# Altium schematic sheet proj_arhipov_buck.SchDoc: =title_line_1 + title_line_2
size 594 x 420 mm; SheetNumber: 2
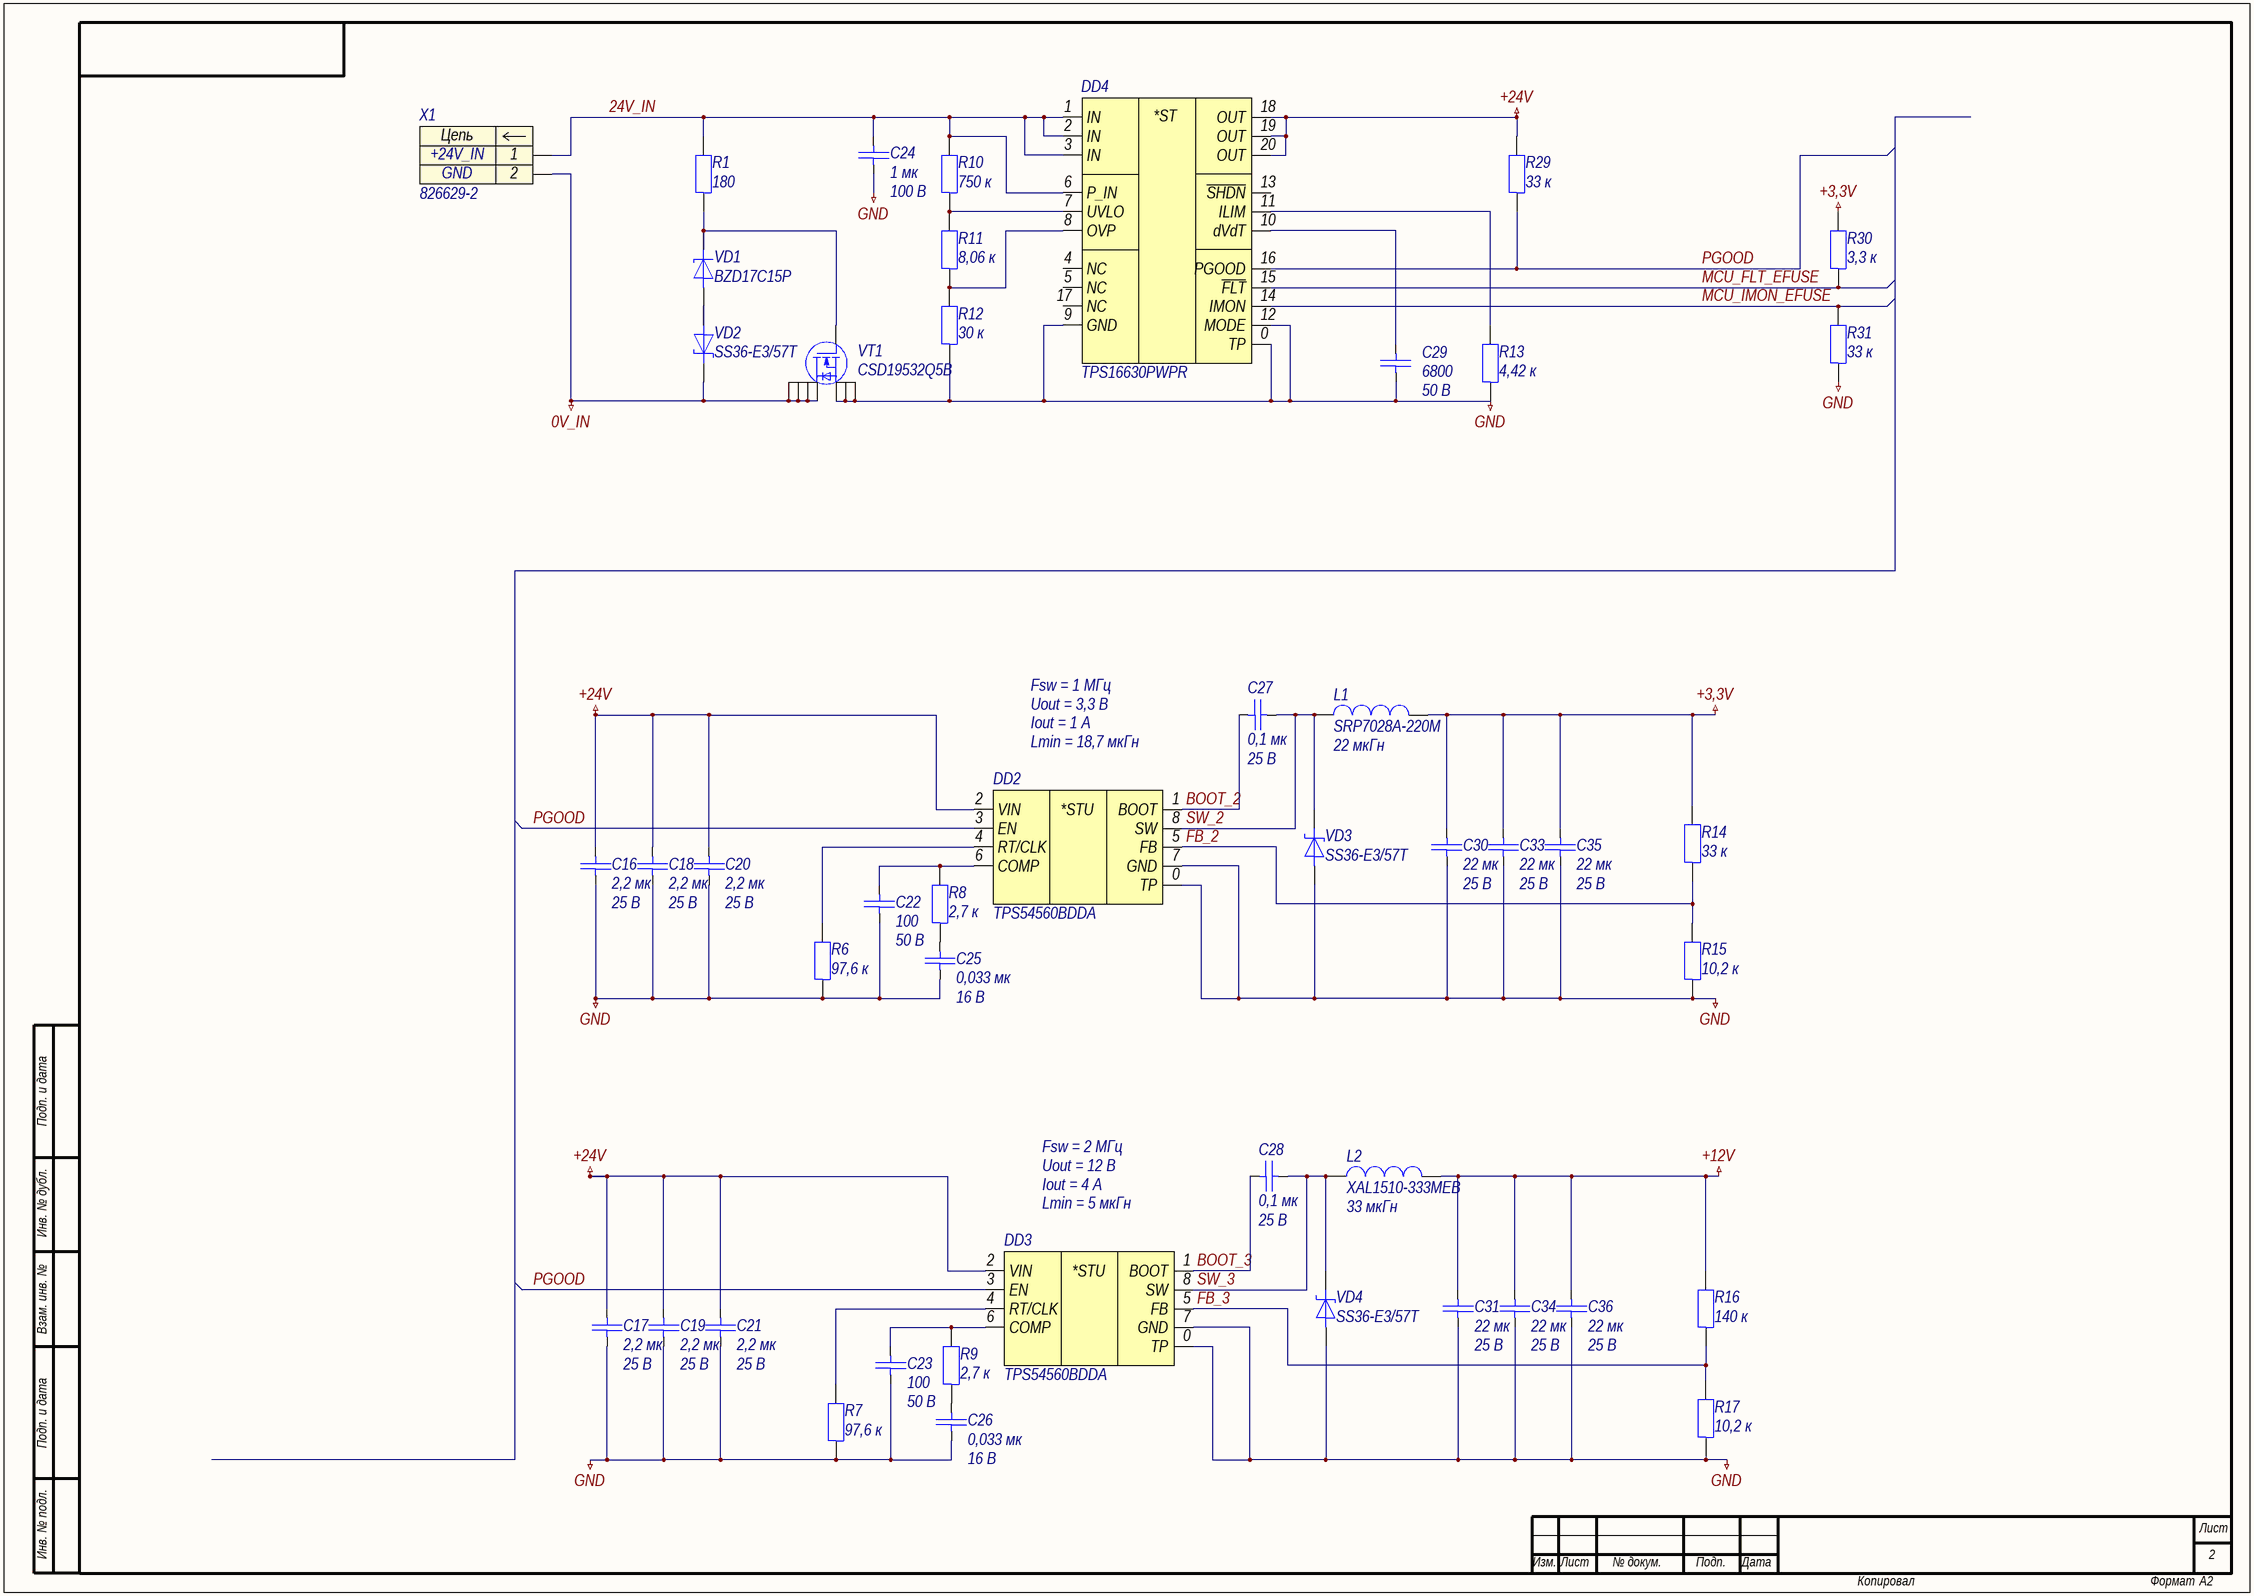
[diagram p0: proj_arhipov_buck.SchDoc]

## Parts
C16  2,2 мк  Напряжение: 25 В  [C0603]
C17  2,2 мк  Напряжение: 25 В  [C0603]
C18  2,2 мк  Напряжение: 25 В  [C0603]
C19  2,2 мк  Напряжение: 25 В  [C0603]
C20  2,2 мк  Напряжение: 25 В  [C0603]
C21  2,2 мк  Напряжение: 25 В  [C0603]
C22  100  Напряжение: 50 В  [C0402]
C23  100  Напряжение: 50 В  [C0402]
C24  1 мк  Напряжение: 100 В  [C1206]
C25  0,033 мк  Напряжение: 16 В  [C0603]
C26  0,033 мк  Напряжение: 16 В  [C0603]
C27  0,1 мк  Напряжение: 25 В  [C0603]
C28  0,1 мк  Напряжение: 25 В  [C0603]
C29  6800  Напряжение: 50 В  [C0402]
C30  22 мк  Напряжение: 25 В  [C1206]
C31  22 мк  Напряжение: 25 В  [C1206]
C33  22 мк  Напряжение: 25 В  [C1206]
C34  22 мк  Напряжение: 25 В  [C1206]
C35  22 мк  Напряжение: 25 В  [C1206]
C36  22 мк  Напряжение: 25 В  [C1206]
DD2  TPS54560BDDA  [HSOIC-8]
DD3  TPS54560BDDA  [HSOIC-8]
DD4  TPS16630PWPR  [HTSSOP-20]
L1  SRP7028A-220M  Индуктивность: 22 мкГн  [SRP-2-730X660X280]
L2  XAL1510-333MEB  Индуктивность: 33 мкГн  [XAL-2-1620X1520X1100]
R1  180  [R0603]
R6  97,6 к  [R0603]
R7  97,6 к  [R0603]
R8  2,7 к  [R0603]
R9  2,7 к  [R0603]
R10  750 к  [R0603]
R11  8,06 к  [R0603]
R12  30 к  [R0603]
R13  4,42 к  [R0603]
R14  33 к  [R0603]
R15  10,2 к  [R0603]
R16  140 к  [R0603]
R17  10,2 к  [R0603]
R29  33 к  [R0603]
R30  3,3 к  [R0603]
R31  33 к  [R0603]
VD1  BZD17C15P  [DO-219AB]
VD2  SS36-E3/57T  [DO-214AB]
VD3  SS36-E3/57T  [DO-214AB]
VD4  SS36-E3/57T  [DO-214AB]
VT1  CSD19532Q5B  [SON-8-500X600X100]
X1  826629-2  [TE_826629-2]

## Nets
0V_IN: VD2.1 VT1.5(D) VT1.6(D) VT1.7(D) VT1.8(D) X1.2
+3,3V: C30.1 C33.1 C35.1 L1.2 R14.2 R30.2
+12V: C31.1 C34.1 C36.1 L2.2 R16.2
+24V: C16.1 C17.1 C18.1 C19.1 C20.1 C21.1 DD2.2(VIN) DD3.2(VIN) DD4.18(OUT) DD4.19(OUT) DD4.20(OUT) R29.2
GND: C16.2 C17.2 C18.2 C19.2 C20.2 C21.2 C22.2 C23.2 C24.2 C25.2 C26.2 C29.2 C30.2 C31.2 C33.2 C34.2 C35.2 C36.2 DD2.0(TP) DD2.7(GND) DD3.0(TP) DD3.7(GND) DD4.0(TP) DD4.9(GND) DD4.12(MODE) R6.1 R7.1 R12.1 R13.1 R15.1 R17.1 R31.1 VD3.2 VD4.2 VT1.1(S) VT1.2(S) VT1.3
24V_IN: C24.1 DD4.1(IN) DD4.2(IN) DD4.3(IN) DD4.6(P_IN) R1.2 R10.2 X1.1
BOOT_2: C27.2 DD2.1(BOOT)
BOOT_3: C28.2 DD3.1(BOOT)
FB_2: DD2.5(FB) R14.1 R15.2
FB_3: DD3.5(FB) R16.1 R17.2
MCU_FLT_EFUSE: DD4.15(~{FLT}) R30.1
MCU_IMON_EFUSE: DD4.14(IMON) R31.2
PGOOD: DD2.3(EN) DD3.3(EN) DD4.16(PGOOD) R29.1
SW_2: C27.1 DD2.8(SW) L1.1 VD3.1
SW_3: C28.1 DD3.8(SW) L2.1 VD4.1
NetC22_1: C22.1 DD2.6(COMP) R8.2
NetC23_1: C23.1 DD3.6(COMP) R9.2
NetC25_1: C25.1 R8.1
NetC26_1: C26.1 R9.1
NetC29_1: C29.1 DD4.10(dVdT)
NetDD2_4: DD2.4(RT/CLK) R6.2
NetDD3_4: DD3.4(RT/CLK) R7.2
NetDD4_7: DD4.7(UVLO) R10.1 R11.2
NetDD4_8: DD4.8(OVP) R11.1 R12.2
NetDD4_11: DD4.11(ILIM) R13.2
NetR1_1: R1.1 VD1.1 VT1.4(G)
NetVD1_2: VD1.2 VD2.2

Not connected (* = marked no-connect by the designer): DD4 4(NC) 5(NC) 13(~{SHDN}) 17(NC)

## Notes on the sheet
- Fsw = 1 МГц
- Uout = 3,3 В
- Iout = 1 А
- Lmin = 18,7 мкГн
- Fsw = 2 МГц
- Uout = 12 В
- Iout = 4 А
- Lmin = 5 мкГн
- Подп. и дата
- Инв. № дубл.
- Взам. инв. №
- Инв. № подл.
- Лист
- Изм.
- № докум.
- Подп.
- Дата
- Копировал
- Формат
- А2
- (in symbol 826629-2) Цепь
- (in symbol dd0002) *ST
- (in symbol dd0009) *STU

## Library data of the parts
C16-C21 = c0100: =Описание; ID: c0100; Фамилия: Паньков; Описание: Конденсатор керамический чип 0603 2,2 мкФ 25 В ±10 %; Наименование: CC0603KRX5R8BB225; Производитель: YAGEO Corp.; Отклонение: ±10 %; Рабочие температуры: от –55 °С до +85 °С; Температурный коэффициент емкости: X5R; Корпус: 0603; Номинал: 2,2 мк; Номинальное напряжение: 25 В; HelpURL: https://www.yageo.com/upload/media/product/productsearch/datasheet/mlcc/UPY-GPHC_X5R_4V-to-50V_26.pdf
C22 C23 = c0004: =Описание; ID: c0004; Фамилия: Ларионов; Описание: Конденсатор керамический чип 0402 100 пФ 50 В ±1 %; Наименование: CL05C101FB5NNNC; Производитель: Samsung Electro-Mechanics; Отклонение: ±1 %; Рабочие температуры: от –55 °С до +125 °С; Температурный коэффициент емкости: C0G; Корпус: 0402; Номинал: 100; Номинальное напряжение: 50 В; HelpURL: http://product.samsungsem.com/mlcc/CL05C101FB5NNN.do
C24 = c0093: =Описание; ID: c0093; Фамилия: Ларионов; Описание: Конденсатор керамический чип 1206 1 мкФ 100 В ±10 %; Наименование: CC1206KKX7R0BB105; Производитель: YAGEO Corp.; Отклонение: ±10 %; Рабочие температуры: от –55 °С до +125 °С; Температурный коэффициент емкости: X7R; Корпус: 1206; Номинал: 1 мк; Номинальное напряжение: 100 В; HelpURL: https://www.yageo.com/upload/media/product/productsearch/datasheet/mlcc/UPY-NP0X7R_MV_100-to-630V_22.pdf
C25 C26 = c0047: =Описание; ID: c0047; Фамилия: Ларионов; Описание: Конденсатор керамический чип 0603 33 нФ 16 В ±5 %; Наименование: CC0603JPX7R7BB333; Производитель: YAGEO Corp.; Отклонение: ±5 %; Рабочие температуры: от –55 °С до +125 °С; Температурный коэффициент емкости: X7R; Корпус: 0603; Номинал: 0,033 мк; Номинальное напряжение: 16 В; HelpURL: https://www.yageo.com/upload/media/product/productsearch/datasheet/mlcc/UPY-GPHC_X7R_6.3V-to-50V_20.pdf
C27 C28 = c0058: =Описание; ID: c0058; Фамилия: Паньков; Описание: Конденсатор керамический чип 0603 100 нФ 25 В ±10 %; Наименование: CC0603KRX7R8BB104; Производитель: YAGEO Corp.; Отклонение: ±10 %; Рабочие температуры: от –55 °С до +125 °С; Температурный коэффициент емкости: X7R; Корпус: 0603; Номинал: 0,1 мк; Номинальное напряжение: 25 В; HelpURL: https://www.yageo.com/upload/media/product/productsearch/datasheet/mlcc/UPY-GPHC_X7R_6.3V-to-50V_20.pdf
C29 = c0005: =Описание; ID: c0005; Фамилия: Жернаков; Описание: Конденсатор керамический чип 0402 6,8 нФ 50 В ±5 %; Наименование: CL05B682JB5NNNC; Производитель: Samsung Electro-Mechanics; Отклонение: ±5 %; Рабочие температуры: от –55 °С до +125 °С; Температурный коэффициент емкости: X7R; Корпус: 0402; Номинал: 6800; Номинальное напряжение: 50 В; HelpURL: http://product.samsungsem.com/mlcc/CL05B682JB5NNN.do
C30 C31 C33-C36 = c0139: =Описание; ID: c0139; Фамилия: Паньков; Описание: Конденсатор керамический чип 1206 22 мкФ 25 В ±10 %; Наименование: CC1206KKX5R8BB226; Производитель: YAGEO Corp.; Отклонение: ±10 %; Рабочие температуры: от –55 °С до +85 °С; Температурный коэффициент емкости: X5R; Корпус: 1206; Номинал: 22 мк; Номинальное напряжение: 25 В; HelpURL: https://www.yageo.com/upload/media/product/productsearch/datasheet/mlcc/UPY-GPHC_X5R_4V-to-50V_26.pdf
DD2 DD3 = dd0009: =Описание; ID: dd0009; Фамилия: Архипов; Описание: Понижающий преобразователь напряжения 60 В и 5 А; Производитель: Texas Instruments; Входное напряжение: от 4,5 В до 60 В; Выходное напряжение: от 0,8 В до 58,8 В; Коммутируемый ток: до 5 А; Частота переключения: от 100 кГц до 2,5 МГц; Рабочие температуры: от –40 °С до +150 °С; Наименование: TPS54560BDDA; Корпус: HSOIC-8; HelpURL: https://www.ti.com/product/TPS54560B
DD4 = dd0002: =Описание; ID: dd0002; Фамилия: Жернаков; Описание: Защитная микросхема eFuse 60 В и 6 А; Производитель: Texas Instruments; Напряжение: от 4,5 В до 60 В; Максимальное напряжение: 67 В; Ток: от 0,6 А до 6 А; Рабочие температуры: от -40 °С до +125 °С; Наименование: TPS16630PWPR; Корпус: HTSSOP-20; HelpURL: https://www.ti.com/product/TPS1663
L1 = l0011: =Описание; ID: l0011; Фамилия: Ларионов; Описание: Катушка индуктивности 22 мкГн ±20 %; Производитель: Bourns, Inc.; Отклонение: ±20 %; Номинальное активное сопротивление: 165 мОм; Максимальное активное сопротивление: 190 мОм; Резонансная частота: 10 МГц; Номинальный ток (при нагреве на 20 °С/40 °С): 2 А; Ток насыщения: 3,5 А; Рабочее напряжение: не указано; Рабочие температуры: от –55 °С до +150 °С; Корпус: 7,3 x 6,6 x 2,8; Наименование: SRP7028A-220M; Номинал: 22 мкГн; HelpURL: https://www.bourns.com/products/magnetic-products/power-inductors-aec-q200-compliant/product/SRP7028A
L2 = l0004: =Описание; ID: l0004; Фамилия: Водорезов; Описание: Катушка индуктивности 33 мкГн ±20 %; Производитель: Coilcraft, Inc.; Отклонение: ±20 %; Номинальное активное сопротивление: 18,7 мОм; Максимальное активное сопротивление: 20 мОм; Резонансная частота: 5,8 МГц; Номинальный ток (при нагреве на 20 °С/40 °С): 8,6 А; Ток насыщения: 16,7 А; Рабочее напряжение: от 0 В до 60 В; Рабочие температуры: от –40 °С до +125 °С; Корпус: 16,2 x 15,2 x 11; Наименование: XAL1510-333MEB; Номинал: 33 мкГн; HelpURL: https://www.coilcraft.com/en-us/products/power/shielded-inductors/molded-inductor/xal/xal1510
R1 = r0013: =Описание; ID: r0013; Фамилия: Паньков; Описание: Резистор чип 0603 180 Ом ±1 % 0,1 Вт; Наименование: RC0603FR-07180RL; Производитель: YAGEO Corp.; Отклонение: ±1 %; Номинальное напряжение: 75 В; Номинальный ток: 1 А; Рабочие температуры: от –55 °С до +155 °С; Корпус: 0603; Примечание: Ряд E24; Номинал: 180; HelpURL: https://www.yageo.com/upload/media/product/productsearch/datasheet/rchip/PYu-RC_Group_51_RoHS_L_11.pdf
R6 R7 = r0029: =Описание; ID: r0029; Фамилия: Водорезов; Описание: Резистор чип 0603 97,6 кОм ±1 % 0,1 Вт; Наименование: RC0603FR-0797K6L; Производитель: YAGEO Corp.; Отклонение: ±1 %; Номинальное напряжение: 75 В; Рабочие температуры: от -55 °С до +155 °С; Номинальный ток: 1 А; Корпус: 0603; Номинал: 97,6 к; HelpURL: https://www.yageo.com/upload/media/product/productsearch/datasheet/rchip/PYu-RC_Group_51_RoHS_L_11.pdf
R8 R9 = r0042: =Описание; ID: r0042; Фамилия: Паньков; Описание: Резистор чип 0603 2,7 кОм ±1 % 0,1 Вт; Наименование: RC0603FR-072K7L; Производитель: YAGEO Corp.; Отклонение: ±1 %; Номинальное напряжение: 75 В; Номинальный ток: 1 А; Рабочие температуры: от –55 °С до +155 °С; Корпус: 0603; Примечание: Ряд E24; Номинал: 2,7 к; HelpURL: https://www.yageo.com/upload/media/product/productsearch/datasheet/rchip/PYu-RC_Group_51_RoHS_L_11.pdf
R10 = r0125: =Описание; ID: r0125; Фамилия: Паньков; Описание: Резистор чип 0603 750 кОм ±1 % 0,1 Вт; Наименование: RC0603FR-07750KL; Производитель: YAGEO Corp.; Отклонение: ±1 %; Номинальное напряжение: 75 В; Номинальный ток: 1 А; Рабочие температуры: от –55 °С до +155 °С; Корпус: 0603; Примечание: Ряд E24; Номинал: 750 к; HelpURL: https://www.yageo.com/upload/media/product/productsearch/datasheet/rchip/PYu-RC_Group_51_RoHS_L_11.pdf
R11 = r0020: =Описание; ID: r0020; Фамилия: Жернаков; Описание: Резистор чип 0603 8,06 кОм ±1 % 0,1 Вт; Наименование: RC0603FR-078K06L; Производитель: YAGEO Corp.; Отклонение: ±1 %; Номинальное напряжение: 75 В; Рабочие температуры: от -55 °С до +155 °С; Номинальный ток: 1 А; Корпус: 0603; Номинал: 8,06 к; HelpURL: https://www.yageo.com/upload/media/product/productsearch/datasheet/rchip/PYu-RC_Group_51_RoHS_L_11.pdf
R12 = r0077: =Описание; ID: r0077; Фамилия: Паньков; Описание: Резистор чип 0603 30 кОм ±1 % 0,1 Вт; Наименование: RC0603FR-0730KL; Производитель: YAGEO Corp.; Отклонение: ±1 %; Номинальное напряжение: 75 В; Номинальный ток: 1 А; Рабочие температуры: от –55 °С до +155 °С; Корпус: 0603; Примечание: Ряд E24; Номинал: 30 к; HelpURL: https://www.yageo.com/upload/media/product/productsearch/datasheet/rchip/PYu-RC_Group_51_RoHS_L_11.pdf
R13 = r0048: =Описание; ID: r0048; Фамилия: Жернаков; Описание: Резистор чип 0603 4,42 кОм ±1 % 0,1 Вт; Наименование: RC0603FR-074K42L; Производитель: YAGEO Corp.; Отклонение: ±1 %; Номинальное напряжение: 75 В; Номинальный ток: 1 А; Рабочие температуры: от –55 °С до +155 °С; Корпус: 0603; Номинал: 4,42 к; HelpURL: https://www.yageo.com/upload/media/product/productsearch/datasheet/rchip/PYu-RC_Group_51_RoHS_L_11.pdf
R14 R29 R31 = r0078: =Описание; ID: r0078; Фамилия: Паньков; Описание: Резистор чип 0603 33 кОм ±1 % 0,1 Вт; Наименование: RC0603FR-0733KL; Производитель: YAGEO Corp.; Отклонение: ±1 %; Номинальное напряжение: 75 В; Номинальный ток: 1 А; Рабочие температуры: от –55 °С до +155 °С; Корпус: 0603; Примечание: Ряд E24; Номинал: 33 к; HelpURL: https://www.yageo.com/upload/media/product/productsearch/datasheet/rchip/PYu-RC_Group_51_RoHS_L_11.pdf
R15 R17 = r0014: =Описание; ID: r0014; Фамилия: Жернаков; Описание: Резистор чип 0603 10,2 кОм ±1 % 0,1 Вт; Наименование: RC0603FR-0710K2L; Производитель: YAGEO Corp.; Отклонение: ±1 %; Номинальное напряжение: 75 В; Рабочие температуры: от -55 °С до +155 °С; Номинальный ток: 1 А; Корпус: 0603; Номинал: 10,2 к; HelpURL: https://www.yageo.com/upload/media/product/productsearch/datasheet/rchip/PYu-RC_Group_51_RoHS_L_11.pdf
R16 = r0101: =Описание; ID: r0101; Фамилия: Шкабара; Описание: Резистор чип 0603 140 кОм ±1 % 0,1 Вт; Наименование: RC0603FR-07140KL; Производитель: YAGEO Corp.; Отклонение: ±1 %; Номинальное напряжение: 75 В; Номинальный ток: 1 А; Рабочие температуры: от –55 °С до +155 °С; Корпус: 0603; Номинал: 140 к; HelpURL: https://www.yageo.com/upload/media/product/productsearch/datasheet/rchip/PYu-RC_Group_51_RoHS_L_11.pdf
R30 = r0044: =Описание; ID: r0044; Фамилия: Паньков; Описание: Резистор чип 0603 3,3 кОм ±1 % 0,1 Вт; Наименование: RC0603FR-073K3L; Производитель: YAGEO Corp.; Отклонение: ±1 %; Номинальное напряжение: 75 В; Номинальный ток: 1 А; Рабочие температуры: от –55 °С до +155 °С; Корпус: 0603; Примечание: Ряд E24; Номинал: 3,3 к; HelpURL: https://www.yageo.com/upload/media/product/productsearch/datasheet/rchip/PYu-RC_Group_51_RoHS_L_11.pdf
VD1 = vd0016: =Описание; ID: vd0016; Фамилия: Жернаков; Описание: Стабилитрон 15 В; Производитель: Vishay Intertechnology, Inc.; Номинальное напряжение стабилизации: 15 В; Разброс напряжения стабилизации: 13,8...15,6 В; Номинальный ток стабилизации: 50 мА; Рабочие температуры: от –55 °С до +150 °С; Наименование: BZD17C15P; Корпус: DO-219AB; HelpURL: https://www.vishay.com/product?docid=85161
VD2-VD4 = vd0005: =Описание; ID: vd0005; Фамилия: Жернаков; Описание: Диод Шоттки 60 В 3 А; Производитель: Vishay Intertechnology, Inc.; Максимальное прямое напряжение: 0,75 В; Максимальное обратное напряжение: 60 В; Максимальный прямой ток: 3 А; Рабочие температуры: от –55 °С до +150 °С; Наименование: SS36-E3/57T; Корпус: DO-214AB; HelpURL: https://www.vishay.com/product?docid=88751
VT1 = vt0001: =Описание; ID: vt0001; Фамилия: Жернаков; Описание: Полевой N-канальный МДП-транзистор 100 В 17 А; Производитель: Texas Instruments; Напряжение затвор — исток: ±20 В; Напряжение сток — исток: 100 В; Ток стока: 17 А; Сопротивление сток — исток: 0,0057 Ом; Рабочие температуры: от –55 °С до +150 °С; Корпус: SON-8; Наименование: CSD19532Q5B; HelpURL: https://www.ti.com/product/CSD19532Q5B
X1 = 826629-2: Number_of_Positions: 2; Centerline_Pitch: 2.54 mm[.1 in]; MF: TE Connectivity; Product_Type: Connector; Contact_1: +24V_IN; Contact_2: GND; Package: None; Value: *; TE_purchase_URL: https://www.te.com/usa-en/product-826629-2.html?te_bu=Cor&te_type=disp&te_campaign=seda_glo_cor-seda-global-disp-prtnr-fy19-seda-model-bom-cta_sma-317_1&elqCampaignId=32493; EU_RoHS_Compliance: Compliant; Availability: Unavailable; SnapEDA_Link: https://www.snapeda.com/parts/826629-2/TE%20Connectivity%20AMP%20Connectors/view-part/494607/?ref=snap; Price: None; MP: 826629-2